# EAGLE schematic SensorTile_Breakout (EAGLE 8.6.0)
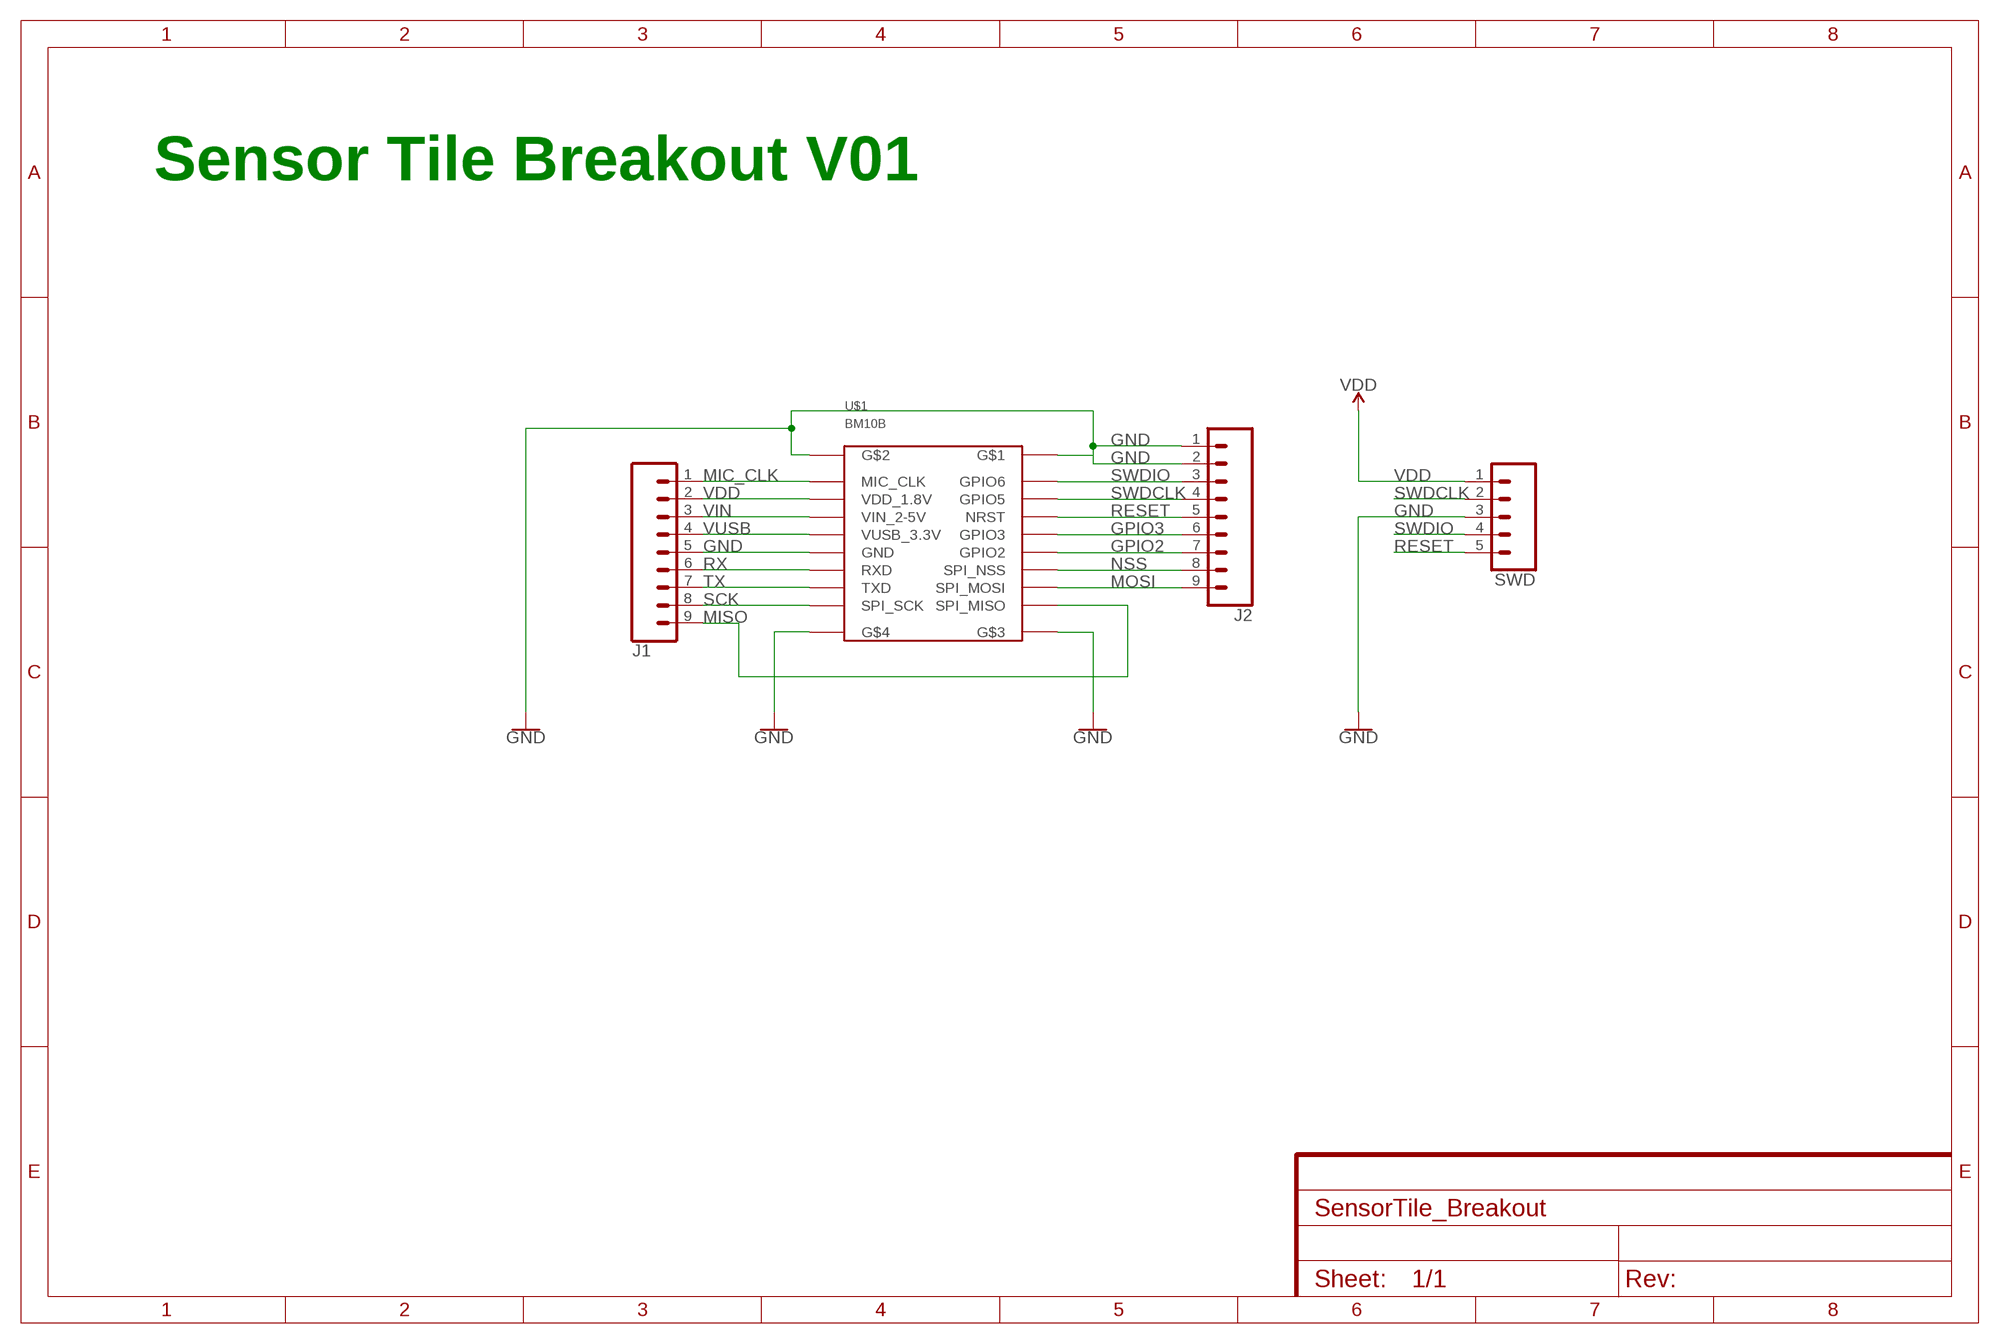
[diagram p0: schematic, sheet 1]

## Parts
J1  CONN_09  [1X09]
J2  CONN_09  [1X09]
SWD  CONN_05  [1X05]
U$1  BM10B  BM10B(0.8)-16DP-0.4V(51)  [BM10B(0.8)-16DP-0.4V(51)]

## Nets
GND: J1.5 J2.1 J2.2 SWD.3 U$1.G$1 U$1.G$2 U$1.G$3 U$1.G$4 U$1.GND$1(GND)
GPIO2: J2.7 U$1.GPIO2
GPIO3: J2.6 U$1.GPIO3
MIC_CLK: J1.1 U$1.MIC_CLK
MISO: J1.9 U$1.SPI_MISO
MOSI: J2.9 U$1.SPI_MOSI
NSS: J2.8 U$1.SPI_NSS
RESET: J2.5 SWD.5 U$1.NRST
RX: J1.6 U$1.RXD
SCK: J1.8 U$1.SPI_SCK
SWDCLK: J2.4 SWD.2 U$1.GPIO5
SWDIO: J2.3 SWD.4 U$1.GPIO6
TX: J1.7 U$1.TXD
VDD: J1.2 SWD.1 U$1.VDD_1.8V
VIN: J1.3 U$1.VIN_2-5V
VUSB: J1.4 U$1.VUSB_3.3V

## Notes on the sheet
- Sensor Tile Breakout V01

## Library data of the parts
J1 J2 = SparkFun-Connectors:CONN_09: Multi connection point. Often used as Generic Header-pin footprint for 0.1 inch spaced/style header connections On any of the 0.1 inch spaced packages, you can populate with these: Break Away Headers - Straight <https://www.sparkfun.com/products/116> (PRT-00116) Break Away Male Headers - Right Angle <https://www.sparkfun.com/products/553> (PRT-00553) Female Headers <https://www.sparkfun.com/products/115> (PRT-00115) Break Away Headers - Machine Pin <https://www.sparkfun.com/products/117> (PRT-00117) Break Away Female Headers - Swiss Machine Pin <https://www.sparkfun.com/products/743> (PRT-00743) For SCREWTERMINALS and SPRING TERMINALS visit here: Screw Terimnals on SparkFun.com <https://www.sparkfun.com/search/results?term=Screw+Terminals> (5mm/3.5mm/2.54mm spacing) This device is also useful as a general connection point to wire up your design to another part of your project. Our various solder wires solder well into these plated through hole pads. Hook-Up Wire - Assortment (Stranded, 22 AWG) <https://www.sparkfun.com/products/11375> (PRT-11375) Hook-Up Wire - Assortment (Solid Core, 22 AWG) <https://www.sparkfun.com/products/11367> (PRT-11367) View the entire wire category on our website here <https://www.sparkfun.com/categories/141> Special notes: Molex polarized connector foot print use with SKU : PRT-08231 with associated crimp pins and housings. 1MM SMD Version SKU: PRT-10208 NOTES ON THE VARIANTS LOCK and LOCK_LONGPADS... This footprint was designed to help hold the alignment of a through-hole component (i.e. 6-pin header) while soldering it into place. You may notice that each hole has been shifted either up or down by 0.005 of an inch from it's more standard position (which is a perfectly straight line). This slight alteration caused the pins (the squares in the middle) to touch the edges of the holes. Because they are alternating, it causes a "brace" to hold the component in place. 0.005 has proven to be the perfect amount of "off-center" position when using our standard breakaway headers. Although looks a little odd when you look at the bare footprint, once you have a header in there, the alteration is very hard to notice. Also,if you push a header all the way into place, it is covered up entirely on the bottom side.
SWD = SparkFun-Connectors:CONN_05: Multi connection point. Often used as Generic Header-pin footprint for 0.1 inch spaced/style header connections On any of the 0.1 inch spaced packages, you can populate with these: Break Away Headers - Straight <https://www.sparkfun.com/products/116> (PRT-00116) Break Away Male Headers - Right Angle <https://www.sparkfun.com/products/553> (PRT-00553) Female Headers <https://www.sparkfun.com/products/115> (PRT-00115) Break Away Headers - Machine Pin <https://www.sparkfun.com/products/117> (PRT-00117) Break Away Female Headers - Swiss Machine Pin <https://www.sparkfun.com/products/743> (PRT-00743) For SCREWTERMINALS and SPRING TERMINALS visit here: Screw Terimnals on SparkFun.com <https://www.sparkfun.com/search/results?term=Screw+Terminals> (5mm/3.5mm/2.54mm spacing) This device is also useful as a general connection point to wire up your design to another part of your project. Our various solder wires solder well into these plated through hole pads. Hook-Up Wire - Assortment (Stranded, 22 AWG) <https://www.sparkfun.com/products/11375> (PRT-11375) Hook-Up Wire - Assortment (Solid Core, 22 AWG) <https://www.sparkfun.com/products/11367> (PRT-11367) View the entire wire category on our website here <https://www.sparkfun.com/categories/141> Special notes: Molex polarized connector foot print use with SKU : PRT-08231 with associated crimp pins and housings. 1MM SMD Version SKU: PRT-10208
U$1 = BM10B(0.8):BM10B(0.8)-16DP-0.4V(51)